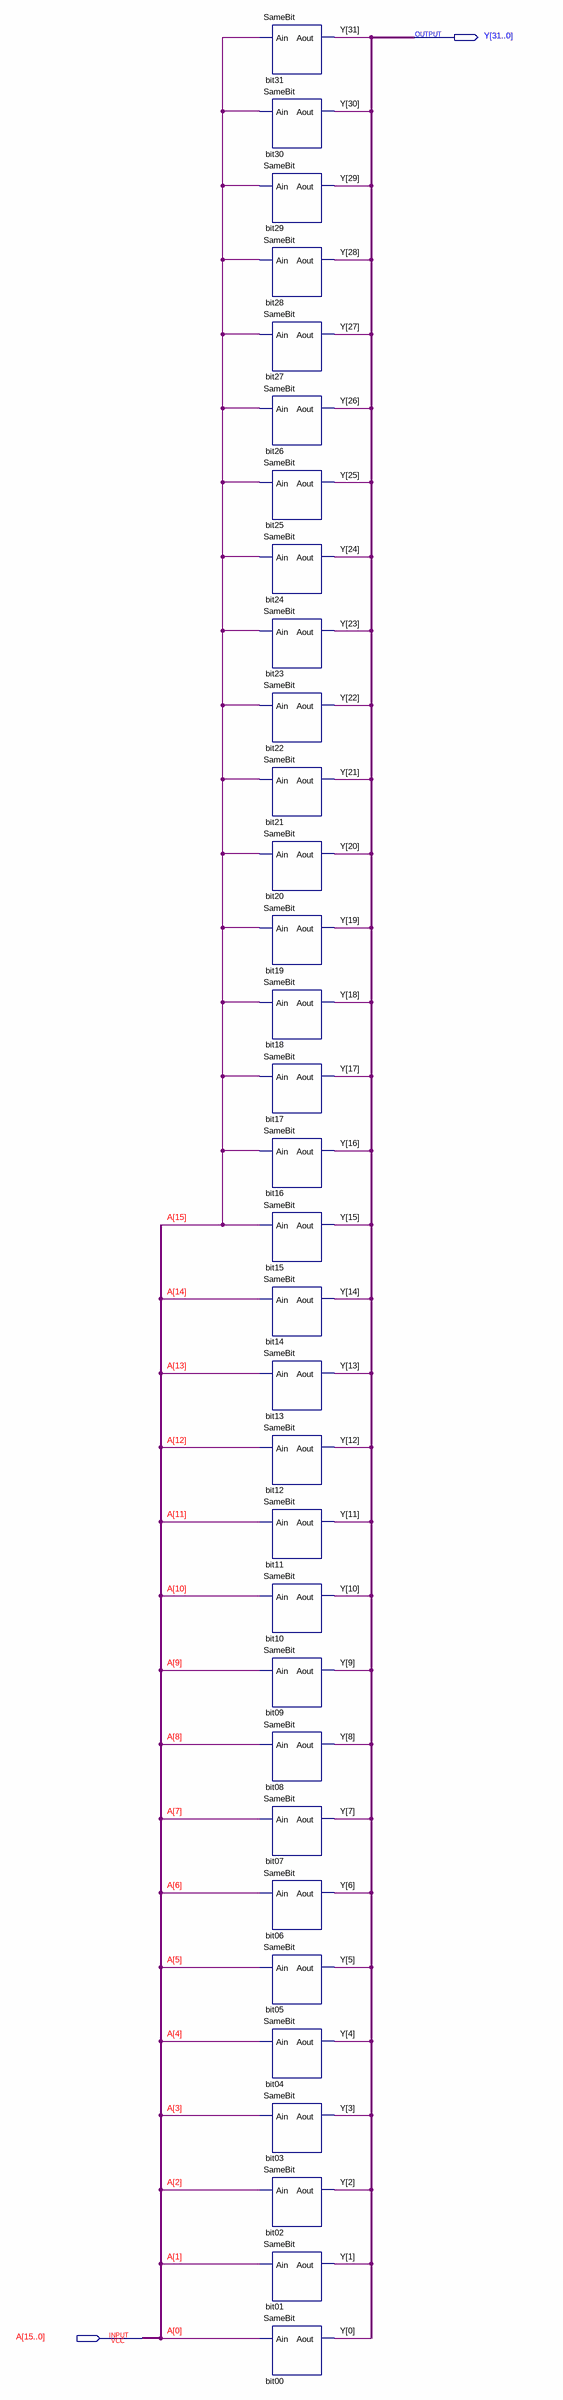
[diagram p0: schematic sheet]
// Quartus schematic SE16_32.bdf as structural Verilog: 32 symbols, 2 pins
module SE16_32 (
  input  [15:0] A,
  output [31:0] Y
);

  SameBit bit31 (.Ain(A[15]), .Aout(Y[31]));
  SameBit bit30 (.Ain(A[15]), .Aout(Y[30]));
  SameBit bit29 (.Ain(A[15]), .Aout(Y[29]));
  SameBit bit28 (.Ain(A[15]), .Aout(Y[28]));
  SameBit bit27 (.Ain(A[15]), .Aout(Y[27]));
  SameBit bit26 (.Ain(A[15]), .Aout(Y[26]));
  SameBit bit25 (.Ain(A[15]), .Aout(Y[25]));
  SameBit bit24 (.Ain(A[15]), .Aout(Y[24]));
  SameBit bit23 (.Ain(A[15]), .Aout(Y[23]));
  SameBit bit22 (.Ain(A[15]), .Aout(Y[22]));
  SameBit bit21 (.Ain(A[15]), .Aout(Y[21]));
  SameBit bit20 (.Ain(A[15]), .Aout(Y[20]));
  SameBit bit19 (.Ain(A[15]), .Aout(Y[19]));
  SameBit bit18 (.Ain(A[15]), .Aout(Y[18]));
  SameBit bit17 (.Ain(A[15]), .Aout(Y[17]));
  SameBit bit16 (.Ain(A[15]), .Aout(Y[16]));
  SameBit bit15 (.Ain(A[15]), .Aout(Y[15]));
  SameBit bit14 (.Ain(A[14]), .Aout(Y[14]));
  SameBit bit13 (.Ain(A[13]), .Aout(Y[13]));
  SameBit bit12 (.Ain(A[12]), .Aout(Y[12]));
  SameBit bit11 (.Ain(A[11]), .Aout(Y[11]));
  SameBit bit10 (.Ain(A[10]), .Aout(Y[10]));
  SameBit bit09 (.Ain(A[9]), .Aout(Y[9]));
  SameBit bit08 (.Ain(A[8]), .Aout(Y[8]));
  SameBit bit07 (.Ain(A[7]), .Aout(Y[7]));
  SameBit bit06 (.Ain(A[6]), .Aout(Y[6]));
  SameBit bit05 (.Ain(A[5]), .Aout(Y[5]));
  SameBit bit04 (.Ain(A[4]), .Aout(Y[4]));
  SameBit bit03 (.Ain(A[3]), .Aout(Y[3]));
  SameBit bit02 (.Ain(A[2]), .Aout(Y[2]));
  SameBit bit01 (.Ain(A[1]), .Aout(Y[1]));
  SameBit bit00 (.Ain(A[0]), .Aout(Y[0]));
endmodule
